# Altium schematic sheet ARM_EURO_Platine6.SchDoc
size A4; PageSetup: Record=PageOptions|CenterHorizontal=True|CenterVertical=True|PrintScale=1.00|XCorrection=1.00|YCorrection=1.00|PrintKind=0|BorderSize=5000000|LeftOffset=0|BottomOffset=0|Orientation=2|PaperLength=1000|PaperWidth=1000|Scale=100|PaperSource=7|PrintQuality=-3|MediaType=1|DitherType=10|PrintScaleMode=1|PaperKind=A4|PaperIndex=9
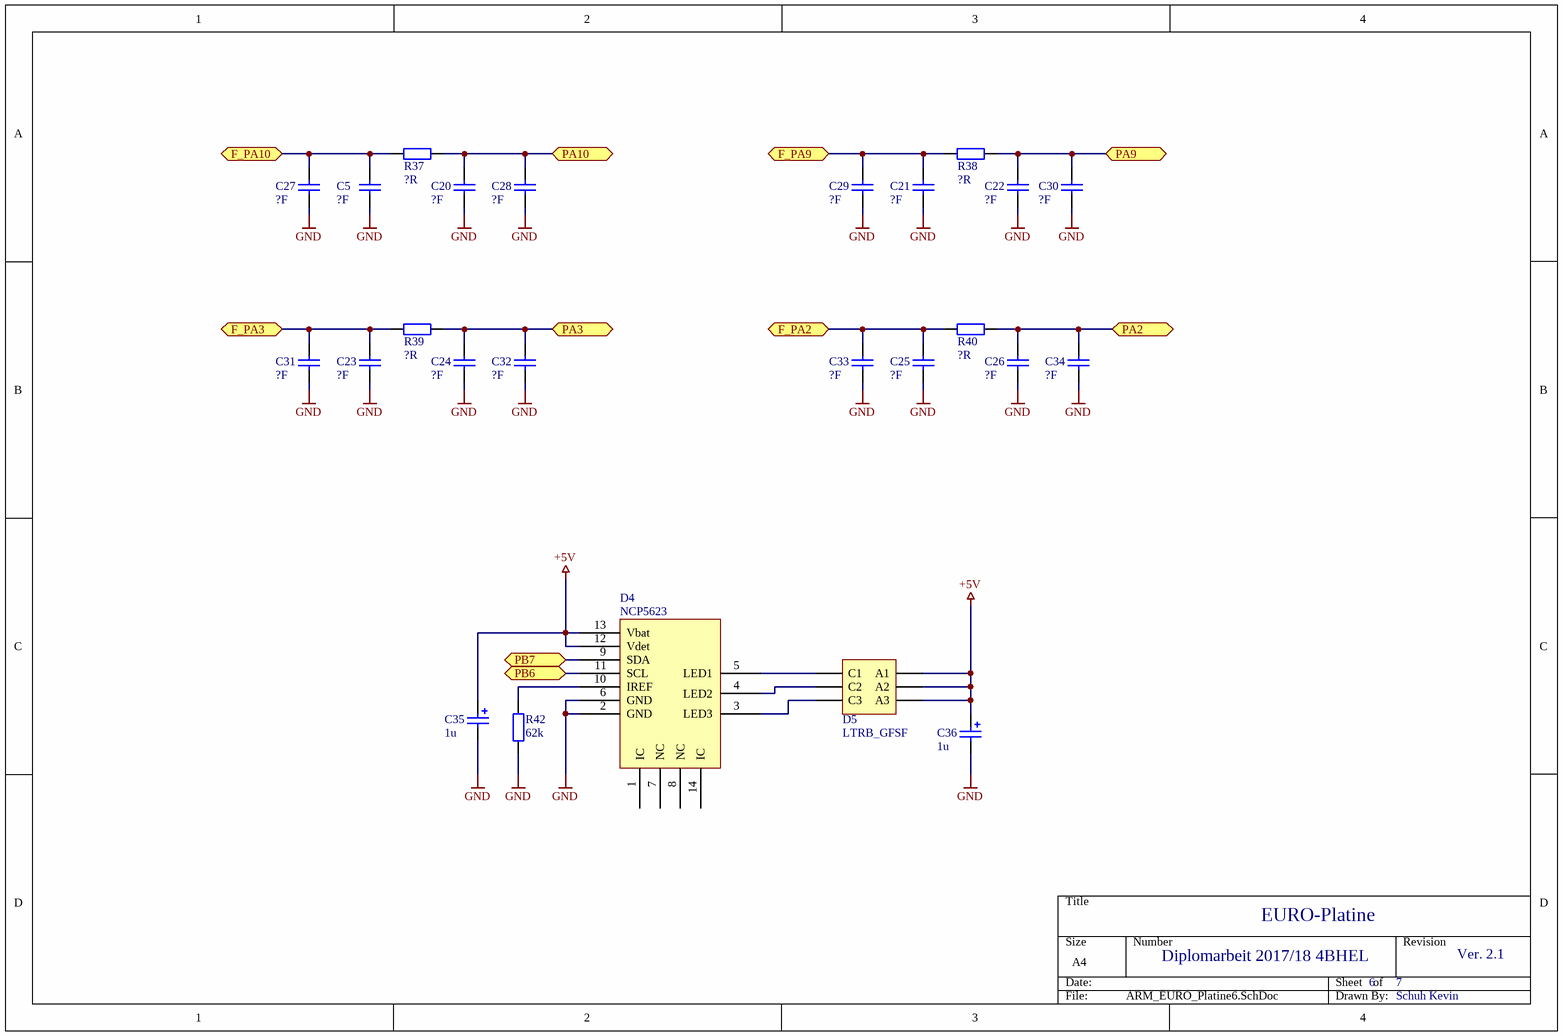
[diagram p0: ARM_EURO_Platine6.SchDoc]

## Parts
C5  value ?F  [0603_CAP]  (hidden comment: Cap_Keramik_SMD)
C20  value ?F  [0603_CAP]  (hidden comment: Cap_Keramik_SMD)
C21  value ?F  [0603_CAP]  (hidden comment: Cap_Keramik_SMD)
C22  value ?F  [0603_CAP]  (hidden comment: Cap_Keramik_SMD)
C23  value ?F  [0603_CAP]  (hidden comment: Cap_Keramik_SMD)
C24  value ?F  [0603_CAP]  (hidden comment: Cap_Keramik_SMD)
C25  value ?F  [0603_CAP]  (hidden comment: Cap_Keramik_SMD)
C26  value ?F  [0603_CAP]  (hidden comment: Cap_Keramik_SMD)
C27  value ?F  [0603_CAP]  (hidden comment: Cap_Keramik_SMD)
C28  value ?F  [0603_CAP]  (hidden comment: Cap_Keramik_SMD)
C29  value ?F  [0603_CAP]  (hidden comment: Cap_Keramik_SMD)
C30  value ?F  [0603_CAP]  (hidden comment: Cap_Keramik_SMD)
C31  value ?F  [0603_CAP]  (hidden comment: Cap_Keramik_SMD)
C32  value ?F  [0603_CAP]  (hidden comment: Cap_Keramik_SMD)
C33  value ?F  [0603_CAP]  (hidden comment: Cap_Keramik_SMD)
C34  value ?F  [0603_CAP]  (hidden comment: Cap_Keramik_SMD)
C35  value 1u  [1411_Cap_Pol_Tantal]  (hidden comment: Cap_Pol_Tantal)
C36  value 1u  [1411_Cap_Pol_Tantal]  (hidden comment: Cap_Pol_Tantal)
D4  NCP5623  [NCP5623]
D5  LTRB_GFSF  [LTRB_GFSF]
R37  value ?R  [0603_Res]  (hidden comment: Res_SMD)
R38  value ?R  [0603_Res]  (hidden comment: Res_SMD)
R39  value ?R  [0603_Res]  (hidden comment: Res_SMD)
R40  value ?R  [0603_Res]  (hidden comment: Res_SMD)
R42  value 62k  [0805_Res]  (hidden comment: Res_SMD)

## Ports
F_PA2, F_PA3, F_PA9, F_PA10, PA2, PA3, PA9, PA10, PB6, PB7

## Nets
+5V: C35.1 C36.1 D4.12(Vdet) D4.13(Vbat) D5.4(A3) D5.5(A2) D5.6(A1)
GND: C5.1 C20.1 C21.1 C22.1 C23.1 C24.1 C25.1 C26.1 C27.1 C28.1 C29.1 C30.1 C31.1 C32.1 C33.1 C34.1 C35.2 C36.2 D4.2(GND) D4.6(GND) R42.1
F_PA2: C25.2 C33.2 R40.1 ; port F_PA2
F_PA3: C23.2 C31.2 R39.1 ; port F_PA3
F_PA9: C21.2 C29.2 R38.1 ; port F_PA9
F_PA10: C5.2 C27.2 R37.1 ; port F_PA10
PA2: C26.2 C34.2 R40.2 ; port PA2
PA3: C24.2 C32.2 R39.2 ; port PA3
PA9: C22.2 C30.2 R38.2 ; port PA9
PA10: C20.2 C28.2 R37.2 ; port PA10
PB6: D4.11(SCL) ; port PB6
PB7: D4.9(SDA) ; port PB7
NetD4_3: D4.3(LED3) D5.3(C3)
NetD4_4: D4.4(LED2) D5.2(C2)
NetD4_5: D4.5(LED1) D5.1(C1)
NetD4_10: D4.10(IREF) R42.2

Not connected (* = marked no-connect by the designer): D4 1(IC) 7(NC) 8(NC) 14(IC)

## Notes on the sheet
- EURO-Platine
- Diplomarbeit 2017/18 4BHEL
- 6
- 7
- Ver. 2.1
- Schuh Kevin

## Library data of the parts
C5 C20-C34 = Cap_Keramik_SMD: Capacitor_SMD; Published: 8-Jun-2000; LatestRevisionDate: 17-Jul-2002; LatestRevisionNote: Re-released for DXP Platform.; PackageReference: RAD-0.3; Publisher: Altium Limited
C35 C36 = Cap_Pol_Tantal: Polarized Capacitor; Published: 8-Jun-2000; LatestRevisionDate: 17-Jul-2002; LatestRevisionNote: Re-released for DXP Platform.; PackageReference: RB7.6-15; Publisher: Altium Limited
D5 = LTRB_GFSF: LTRB-GFSF; LatestRevisionDate: 17-Jul-2002; LatestRevisionNote: Re-released for DXP Platform.; Publisher: Altium Limited
R37-R40 R42 = Res_SMD: Resistor; Published: 8-Jun-2000; LatestRevisionDate: 17-Jul-2002; LatestRevisionNote: Re-released for DXP Platform.; PackageReference: AXIAL-0.4; Publisher: Altium Limited